# Altium project YarnControl_Driver_v1.3.PrjPCB
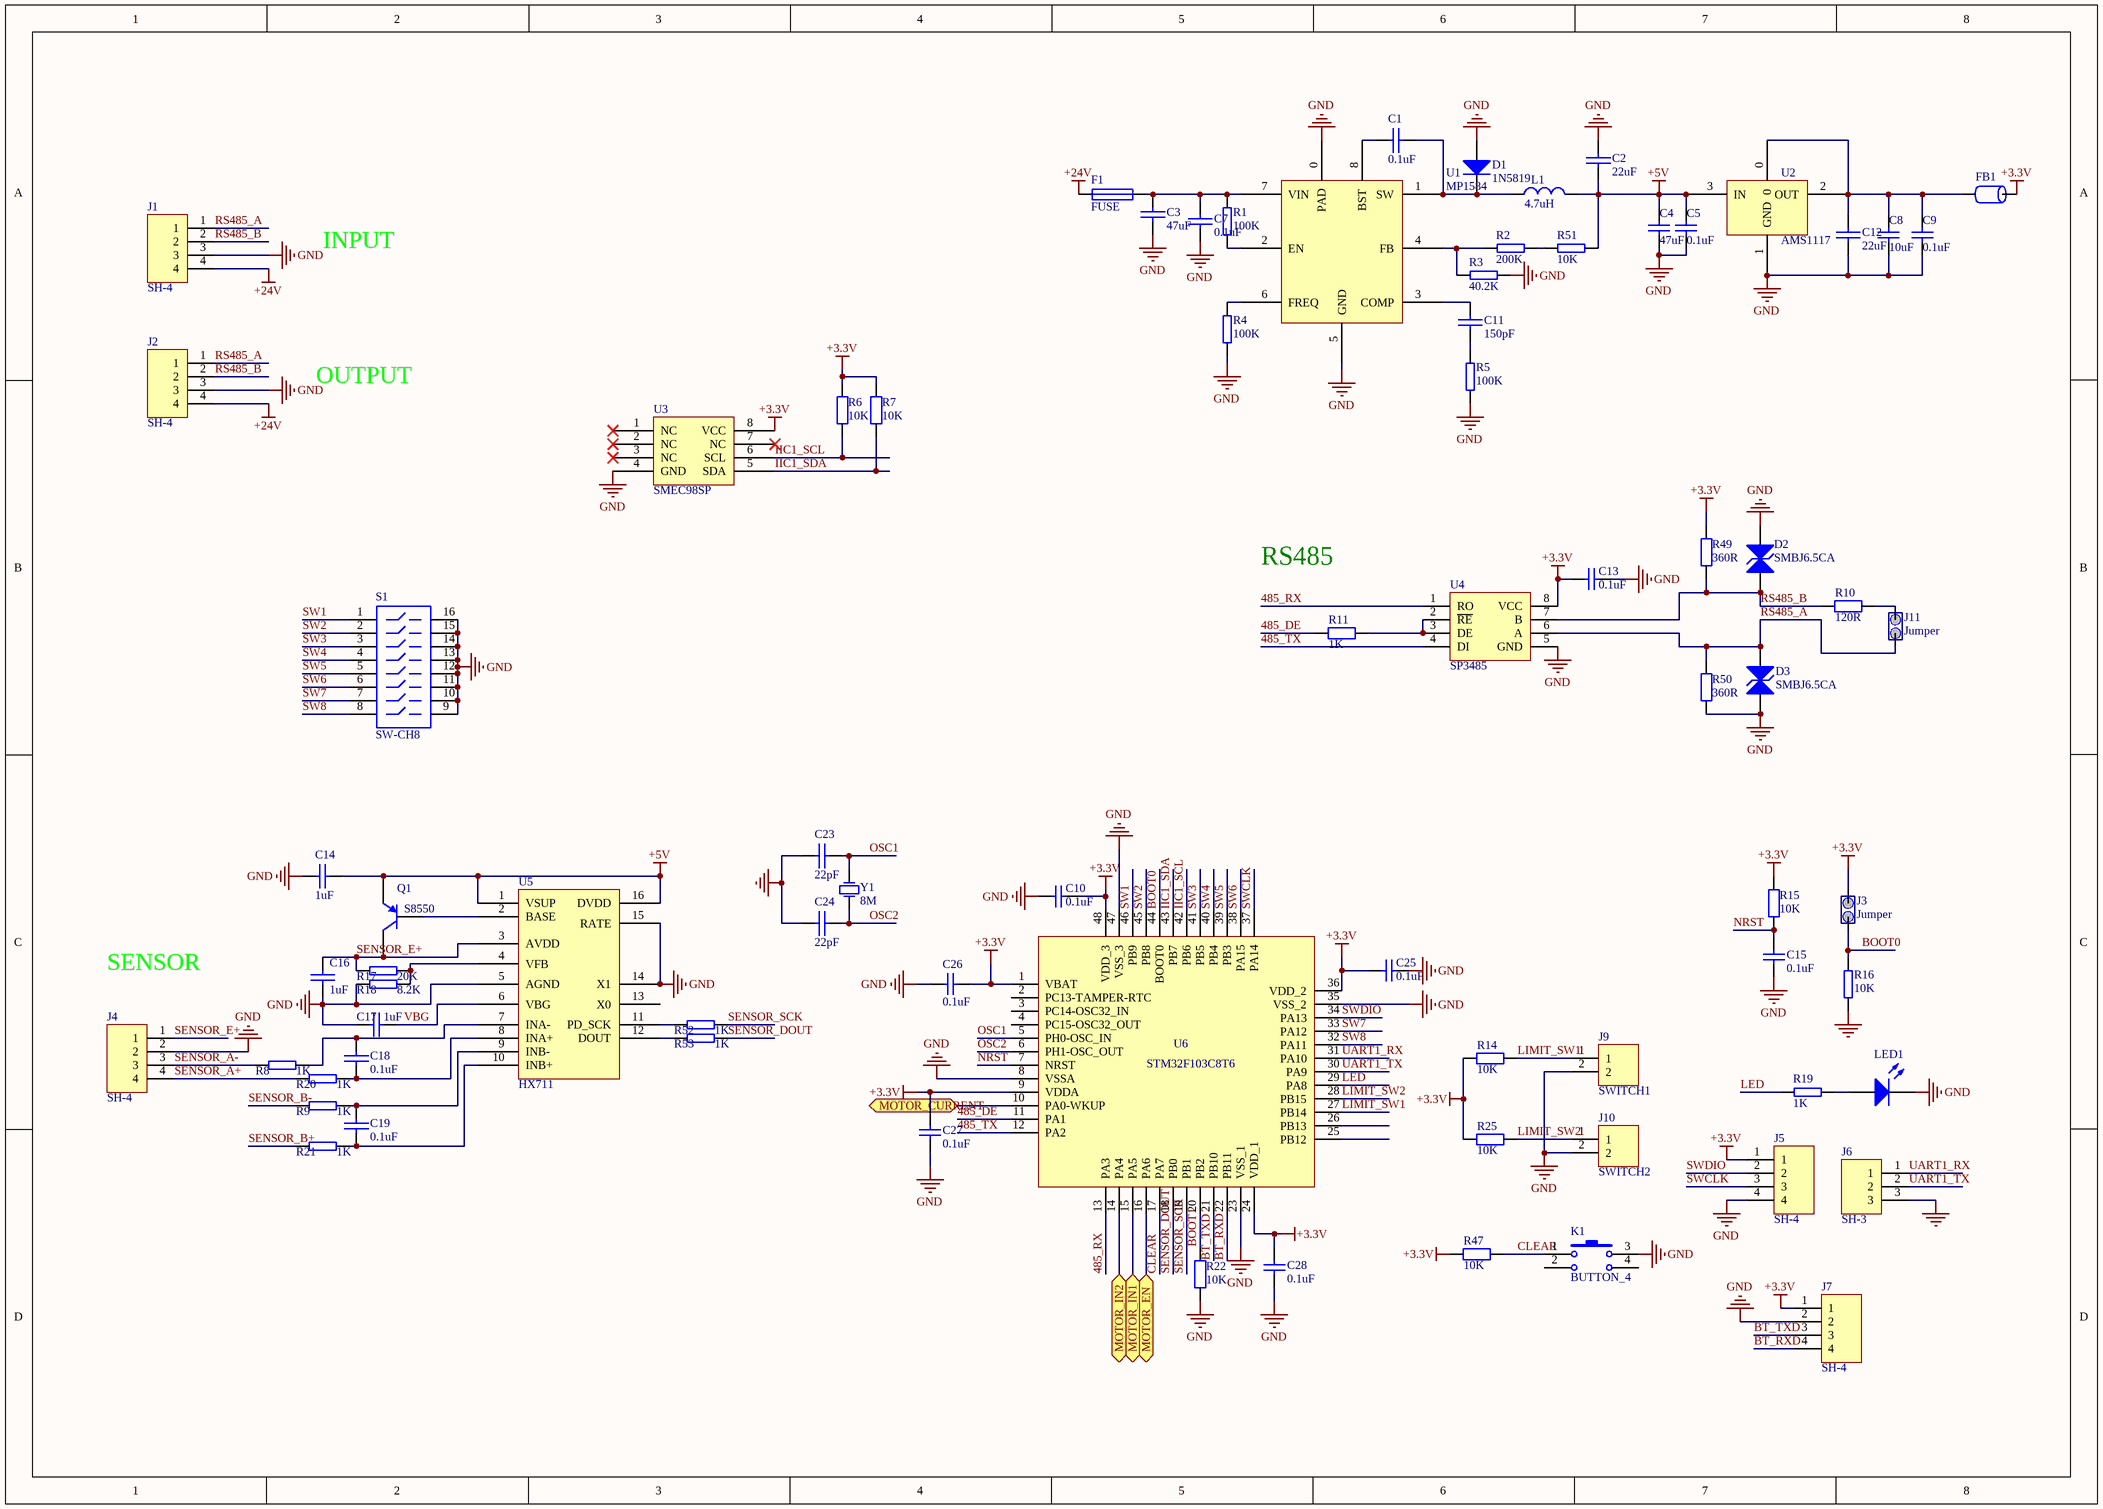
[diagram p0: YarnControl_Driver_v1.3.SchDoc]
1 sheet, 78 parts. Net scope: flat (ports and power ports of the same name join across sheets).
Board file: YarnControl_Driver_v1.3.PcbDoc

## Sheet YarnControl_Driver_v1.3.SchDoc
size A3

### Parts
C1  0.1uF  [0805]
C2  22uF  [1206]
C3  47uF  [1812]
C4  47uF  [1210]
C5  0.1uF  [0805]
C7  0.1uF  [0805]
C8  10uF  [0805]
C9  0.1uF  [0805]
C10  0.1uF  [0805]
C11  150pF  [0805]
C12  22uF  [1206]
C13  0.1uF  [0805]
C14  1uF  [0805]
C15  0.1uF  [0805]
C16  1uF  [0805]
C17  1uF  [0805]
C18  0.1uF  [0805]
C19  0.1uF  [0805]
C23  22pF  [0805]
C24  22pF  [0805]
C25  0.1uF  [0805]
C26  0.1uF  [0805]
C27  0.1uF  [0805]
C28  0.1uF  [0805]
D1  1N5819  [Diode_TP2]
D2  SMBJ6.5CA  [SMBJ_DO-214]
D3  SMBJ6.5CA  [SMBJ_DO-214]
F1  FUSE  [1206]
FB1  FERRITE  [0805]  (value not drawn)
J1  SH-4  [J381-4-90]
J2  SH-4  [J381-4-90]
J3  Jumper  [J254-2]
J4  SH-4  [KF2510-4]
J5  SH-4  [J254-4]
J6  SH-3  [J2.54-3]
J7  SH-4  [J254-4]
J9  SWITCH1  [XH2.54-2T]
J10  SWITCH2  [XH2.54-2T]
J11  Jumper  [J254-2]
K1  BUTTON_4  [Button1]
L1  4.7uH  [Inductance6*6]
LED1  GREEN  [LED]  (value not drawn)
Q1  S8550  [901X_SOT-23]
R1  100K  [0805]
R2  200K  [0805]
R3  40.2K  [0805]
R4  100K  [0805]
R5  100K  [0805]
R6  10K  [0805]
R7  10K  [0805]
R8  1K  [0805]
R9  1K  [0805]
R10  120R  [0805]
R11  1K  [0805]
R14  10K  [0805]
R15  10K  [0805]
R16  10K  [0805]
R17  20K  [0805]
R18  8.2K  [0805]
R19  1K  [0805]
R20  1K  [0805]
R21  1K  [0805]
R22  10K  [0805]
R25  10K  [0805]
R47  10K  [0805]
R49  360R  [0805]
R50  360R  [0805]
R51  10K  [0805]
R52  1K  [0805]
R53  1K  [0805]
S1  SW-CH8  [SWITCH_8]
U1  MP1584  [MP1584]
U2  AMS1117  [TO-223]
U3  SMEC98SP  [SO-8]
U4  SP3485  [SO-8]
U5  HX711  [SO-16]
U6  STM32F103C8T6  [LQFP_48]
Y1  8M  [XTAL]

### Ports
MOTOR_CURRENT, MOTOR_EN, MOTOR_IN1, MOTOR_IN2

### Nets
+3.3V: C10.1 C13.2 C25.2 C26.2 C27.2 C28.2 FB1.2 J3.2 J5.1 J7.1 R6.2 R7.2 R14.2 R15.2 R25.1 R47.1 R49.2 U3.8(VCC) U4.8(VCC) U6.1(VBAT) U6.9(VDDA) U6.24(VDD_1) U6.36(VDD_2) U6.48(VDD_3)
+5V: C2.2 C4.2 C5.2 C14.2 L1.2 Q1.3(E) R51.1 U2.3(IN) U5.1(VSUP) U5.16(DVDD)
+24V: F1.1 J1.4 J2.4
GND: C2.1 C3.2 C4.1 C5.1 C7.2 C8.1 C9.1 C10.2 C12.2 C13.1 C14.1 C15.1 C16.1 C17.2 C23.1 C24.1 C25.1 C26.1 C27.1 C28.1 D1.1(A) D2.2(K) D3.1(A) J1.3 J2.3 J4.2 J5.4 J6.3 J7.2 J9.2 J10.2 K1.3 LED1.2(K) R3.1 R4.1 R5.1 R16.2 R18.2 R22.1 R50.1 S1.9 S1.10 S1.11 S1.12 S1.13 S1.14 S1.15 S1.16 U1.0(PAD) U1.5(GND) U2.1(GND) U3.4(GND) U4.5(GND) U5.5(AGND) U5.14(X1) U5.15(RATE) U6.8(VSSA) U6.23(VSS_1) U6.35(VSS_2) U6.47(VSS_3)
485_DE: R11.2 U6.11(PA1)
485_RX: U4.1(RO) U6.13(PA3)
485_TX: U4.4(DI) U6.12(PA2)
BOOT0: J3.1 R16.1 U6.44(BOOT0)
BOOT1: R22.2 U6.20(PB2)
BT_RXD: J7.4 U6.22(PB11)
BT_TXD: J7.3 U6.21(PB10)
CLEAR: K1.1 R47.2 U6.17(PA7)
IIC1_SCL: R6.1 U3.6(SCL) U6.42(PB6)
IIC1_SDA: R7.1 U3.5(SDA) U6.43(PB7)
LED: R19.2 U6.29(PA8)
LIMIT_SW1: J9.1 R14.1 U6.27(PB14)
LIMIT_SW2: J10.1 R25.2 U6.28(PB15)
NRST: C15.2 R15.1 U6.7(NRST)
OSC1: C23.2 U6.5(PH0-OSC_IN) Y1.2(OSC2)
OSC2: C24.2 U6.6(PH1-OSC_OUT) Y1.1(OSC1)
RS485_A: D3.2(K) J1.1 J2.1 J11.1 R50.2 U4.6(A)
RS485_B: D2.1(A) J1.2 J2.2 R10.1 R49.1 U4.7(B)
SENSOR_A+: J4.4 R20.2
SENSOR_A-: J4.3 R8.2
SENSOR_B+: R21.2
SENSOR_B-: R9.2
SENSOR_DOUT: R53.1 U6.18(PB0)
SENSOR_E+: C16.2 J4.1 Q1.1(C) R17.2 U5.3(AVDD)
SENSOR_SCK: R52.1 U6.19(PB1)
SW1: S1.1 U6.46(PB9)
SW2: S1.2 U6.45(PB8)
SW3: S1.3 U6.41(PB5)
SW4: S1.4 U6.40(PB4)
SW5: S1.5 U6.39(PB3)
SW6: S1.6 U6.38(PA15)
SW7: S1.7 U6.33(PA12)
SW8: S1.8 U6.32(PA11)
SWCLK: J5.3 U6.37(PA14)
SWDIO: J5.2 U6.34(PA13)
UART1_RX: J6.1 U6.31(PA10)
UART1_TX: J6.2 U6.30(PA9)
VBG: C17.1 U5.6(VBG)
NetC1_1: C1.1 U1.8(BST)
NetC1_2: C1.2 D1.2(K) L1.1 U1.1(SW)
NetC3_1: C3.1 C7.1 F1.2 R1.2 U1.7(VIN)
NetC8_2: C8.2 C9.2 C12.1 FB1.1 U2.0 U2.2(OUT)
NetC11_1: C11.1 U1.3(COMP)
NetC11_2: C11.2 R5.2
NetC18_1: C18.1 R8.1 U5.7(INA-)
NetC18_2: C18.2 R20.1 U5.8(INA+)
NetC19_1: C19.1 R9.1 U5.9(INB-)
NetC19_2: C19.2 R21.1 U5.10(INB+)
NetJ11_2: J11.2 R10.2
NetLED1_1: LED1.1(A) R19.1
NetQ1_2: Q1.2(B) U5.2(BASE)
NetR1_1: R1.1 U1.2(EN)
NetR2_1: R2.1 R51.2
NetR2_2: R2.2 R3.2 U1.4(FB)
NetR4_2: R4.2 U1.6(FREQ)
NetR11_1: R11.1 U4.2(~{RE}) U4.3(DE)
NetR17_1: R17.1 R18.1 U5.4(VFB)
NetR52_2: R52.2 U5.11(PD_SCK)
NetR53_2: R53.2 U5.12(DOUT)
NetU6_10: U6.10(PA0-WKUP) ; port MOTOR_CURRENT
NetU6_14: U6.14(PA4) ; port MOTOR_IN2
NetU6_15: U6.15(PA5) ; port MOTOR_IN1
NetU6_16: U6.16(PA6) ; port MOTOR_EN

Not connected (* = marked no-connect by the designer): K1 2 4; U3 1(NC)* 2(NC)* 3(NC)* 7(NC)*; U5 13(X0); U6 2(PC13-TAMPER-RTC) 3(PC14-OSC32_IN) 4(PC15-OSC32_OUT) 25(PB12) 26(PB13)

### Notes on the sheet
- INPUT
- OUTPUT
- RS485
- SENSOR

### Library data of the parts
C1-C3 C7 C11 C12 C14 C16-C19 C23 C24 = CAP: 电容
C4 C5 C8 C9 = Cap0805
C10 C13 C15 C25-C28 = Cap: Capacitor; Value: 100pF; Published: 8-Jun-2000; LatestRevisionDate: 17-Jul-2002; LatestRevisionNote: Re-released for DXP Platform.; PackageReference: RAD-0.3; Publisher: Altium Limited
D1 = Diode: 二极管; Published: 8-Jun-2000; LatestRevisionDate: 17-Jul-2002; LatestRevisionNote: Re-released for DXP Platform.; PackageVersion: Sep-1996; PackageReference: SMC; Publisher: Altium Limited; PackageDescription: DO-214-AB/SMC; 2 C-Bend Leads; Body 7.9 x 5.9 mm, inc. leads (LxW); Code_JEDEC: DO-214-AB
D2 D3 = TVS: Published: 8-Jun-2000; LatestRevisionDate: 17-Jul-2002; LatestRevisionNote: Re-released for DXP Platform.; PackageReference: DIODE-0.7; Publisher: Altium Limited
F1 = FUSE: 保险丝
J9 J10 = SH-2
L1 = Inductor: 电感
LED1 = LED2: Typical RED, GREEN, YELLOW, AMBER GaAs LED; Published: 8-Jun-2000; Revision: July-2002: Re-released for DXP Platform.; Publisher: Altium Limited
Q1 = PNP
R1-R5 R8 R9 R16-R21 R51-R53 = RES: 电阻
R6 R7 R10 R14 R15 R22 R25 R47 R49 R50 = Res2: Resistor; Value: 1K; Published: 8-Jun-2000; LatestRevisionDate: 17-Jul-2002; LatestRevisionNote: Re-released for DXP Platform.; PackageReference: AXIAL-0.4; Publisher: Altium Limited
R11 = Res2: Resistor; Published: 8-Jun-2000; LatestRevisionDate: 17-Jul-2002; LatestRevisionNote: Re-released for DXP Platform.; PackageReference: AXIAL-0.4; Publisher: Altium Limited; Value: 1K
S1 = SW-CH8: 拨码开关CH8; Published: 24-Mar-1999; LatestRevisionDate: 17-Dec-2003; LatestRevisionNote: PCB Footprint replaced.; PackageReference: DIP-16-KEY; Publisher: Altium Limited; PackageDescription: DIP; 16 Leads; Row Spacing 7.62 mm; Pitch 2.54 mm; ComponentLink1Description: Manufacturer Link; ComponentLink1URL: http://www.oupiin.com/prodindx.html#Headers
U4 = SP3485: 485
Y1 = XTAL: Crystal Oscillator; Published: 8-Jun-2000; LatestRevisionDate: 17-Jul-2002; LatestRevisionNote: Re-released for DXP Platform.; PackageReference: R38; Publisher: Altium Limited